# Altium schematic sheet [2]-BLOCK_DIAGRAM.SchDoc
size A4
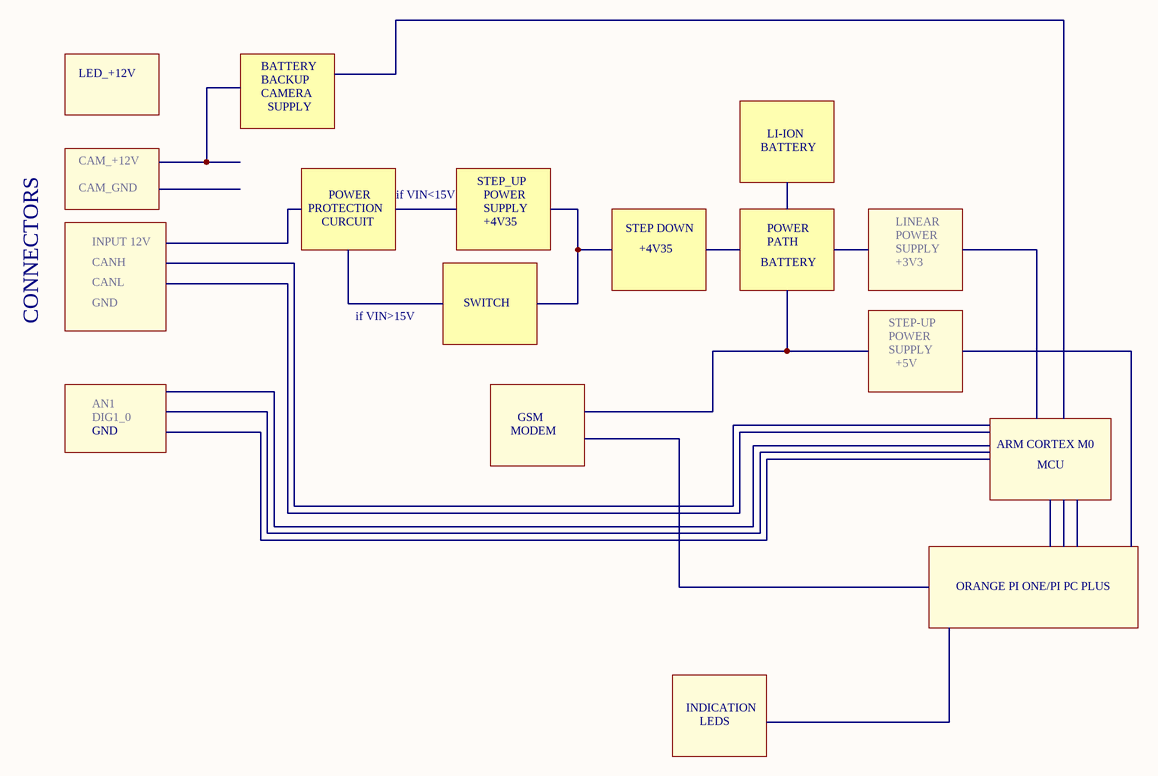
[diagram p0: [2]-BLOCK_DIAGRAM.SchDoc]

## Notes on the sheet
- LED_+12V
- BATTERY
- BACKUP
- CAMERA
- CAM_+12V
- SUPPLY
- LI-ION
- CAM_GND
- PROTECTION
- CURCUIT
- POWER
- if VIN<15V
- STEP_UP
- +4V35
- STEP DOWN
- LINEAR
- INPUT 12V
- CANH
- CANL
- PATH
- +3V3
- CONNECTORS
- GND
- if VIN>15V
- SWITCH
- STEP-UP
- +5V
- AN1
- DIG1_0
- MODEM
- GSM
- ARM CORTEX M0
- MCU
- ORANGE PI ONE/PI PC PLUS
- INDICATION
- LEDS